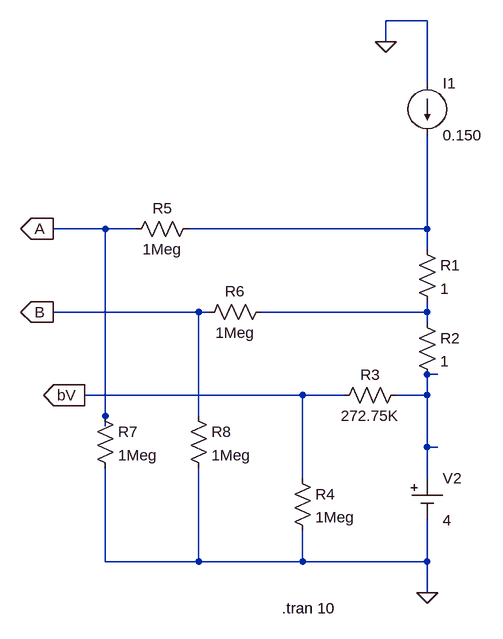
[diagram p0: schematic Battery_charging.asc]
Battery_charging.asc, the LTspice schematic file:
Version 4
SHEET 1 880 1432
WIRE 144 208 80 208
WIRE 80 240 80 208
WIRE 144 304 144 208
WIRE -352 528 -432 528
WIRE -304 528 -352 528
WIRE 144 528 144 384
WIRE 144 528 -224 528
WIRE 144 560 144 528
WIRE -208 656 -432 656
WIRE -192 656 -208 656
WIRE 144 656 144 640
WIRE 144 656 -112 656
WIRE 144 672 144 656
WIRE 160 752 144 752
WIRE -48 784 -384 784
WIRE 16 784 -48 784
WIRE 144 784 144 752
WIRE 144 784 96 784
WIRE -352 816 -352 528
WIRE -208 816 -208 656
WIRE -352 832 -352 816
WIRE 144 864 144 784
WIRE 160 864 144 864
WIRE -48 912 -48 784
WIRE 144 912 144 864
WIRE -352 1040 -352 896
WIRE -208 1040 -208 896
WIRE -208 1040 -352 1040
WIRE -48 1040 -48 992
WIRE -48 1040 -208 1040
WIRE 144 1040 144 976
WIRE 144 1040 -48 1040
WIRE 144 1088 144 1040
FLAG 144 1088 0
FLAG 80 240 0
FLAG -384 784 bV
IOPIN -384 784 Out
FLAG -432 528 A
IOPIN -432 528 Out
FLAG -432 656 B
IOPIN -432 656 Out
SYMBOL res 128 544 R0
SYMATTR InstName R1
SYMATTR Value 1
SYMBOL res 0 800 R270
WINDOW 0 32 56 VTop 2
WINDOW 3 0 56 VBottom 2
SYMATTR InstName R3
SYMATTR Value 272.75K
SYMBOL res -64 896 R0
SYMATTR InstName R4
SYMATTR Value 1Meg
SYMBOL Misc\\cell 144 912 R0
WINDOW 123 0 0 Left 0
WINDOW 39 0 0 Left 0
SYMATTR InstName V2
SYMATTR Value 4
SYMBOL res 128 656 R0
SYMATTR InstName R2
SYMATTR Value 1
SYMBOL res -208 512 R90
WINDOW 0 0 56 VBottom 2
WINDOW 3 32 56 VTop 2
SYMATTR InstName R5
SYMATTR Value 1Meg
SYMBOL res -96 640 R90
WINDOW 0 0 56 VBottom 2
WINDOW 3 32 56 VTop 2
SYMATTR InstName R6
SYMATTR Value 1Meg
SYMBOL res -368 800 R0
SYMATTR InstName R7
SYMATTR Value 1Meg
SYMBOL res -224 800 R0
SYMATTR InstName R8
SYMATTR Value 1Meg
SYMBOL current 144 304 R0
WINDOW 123 0 0 Left 0
WINDOW 39 0 0 Left 0
SYMATTR InstName I1
SYMATTR Value 0.150
TEXT -80 1112 Left 2 !.tran 10

The netlist it stands for:
* Battery_charging.asc
R1 N001 N002 1
R3 bV N003 272.75K
R4 bV 0 1Meg
V2 N003 0 4
R2 N002 N003 1
R5 N001 A 1Meg
R6 N002 B 1Meg
R7 A 0 1Meg
R8 B 0 1Meg
I1 0 N001 0.150
.tran 10
.backanno
.end